# EAGLE design Relay_outputs1_double (EAGLE 7.5.0)
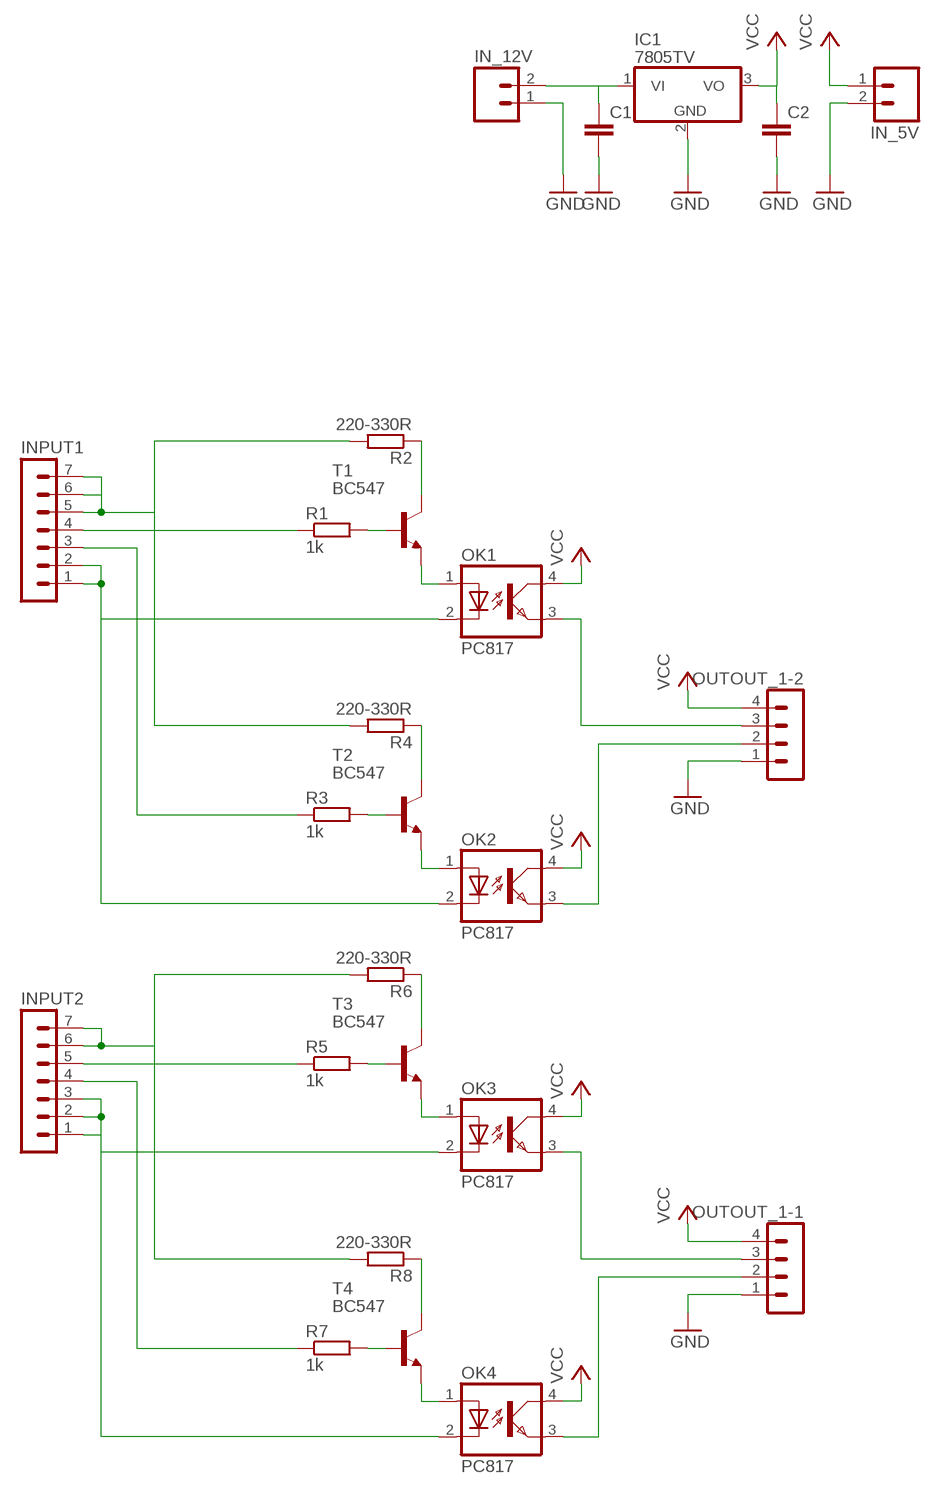
[diagram p0: schematic, sheet 1]

## Parts
C1  C-EU050-024X044  [C050-024X044]
C2  C-EU050-024X044  [C050-024X044]
IC1  7805TV  [TO220V]
IN_5V  MA02  [02PA]
IN_12V  MA02  [02PA]
INPUT1  MA07-1  [MA07-1]
INPUT2  MA07-1  [MA07-1]
OK1  PC817  [DIL04]
OK2  PC817  [DIL04]
OK3  PC817  [DIL04]
OK4  PC817  [DIL04]
OUTOUT_1-1  MA04-1  [MA04-1]
OUTOUT_1-2  MA04-1  [MA04-1]
R1  1k  R-EU_0207/10  [0207/10]
R2  220-330R  R-EU_0207/10  [0207/10]
R3  1k  R-EU_0207/10  [0207/10]
R4  220-330R  R-EU_0207/10  [0207/10]
R5  1k  R-EU_0207/10  [0207/10]
R6  220-330R  R-EU_0207/10  [0207/10]
R7  1k  R-EU_0207/10  [0207/10]
R8  220-330R  R-EU_0207/10  [0207/10]
T1  BC547  [TO92]
T2  BC547  [TO92]
T3  BC547  [TO92]
T4  BC547  [TO92]

## Nets
DC_IN: C1.1 IC1.1(VI) IN_12V.2
GND: C1.2 C2.2 IC1.2(GND) IN_5V.2 IN_12V.1 OUTOUT_1-1.1 OUTOUT_1-2.1
INPUT_REGULATED_CURR_2_BASE: R1.2 T1.2(B)
INPUT_REGULATED_CURR_2_BASE1: R3.2 T2.2(B)
INPUT_REGULATED_CURR_2_BASE2: R5.2 T3.2(B)
INPUT_REGULATED_CURR_2_BASE3: R7.2 T4.2(B)
N$1: R6.1 T3.3(C)
N$2: R2.1 T1.3(C)
N$3: R4.1 T2.3(C)
N$4: R8.1 T4.3(C)
OPTO_IN: OK1.1(A) T1.1(E)
OPTO_IN1: OK2.1(A) T2.1(E)
OPTO_IN2: OK3.1(A) T3.1(E)
OPTO_IN3: OK4.1(A) T4.1(E)
OUT1: OK1.3(EMIT) OUTOUT_1-2.3
OUT2: OK2.3(EMIT) OUTOUT_1-2.2
OUT3: OK3.3(EMIT) OUTOUT_1-1.3
OUT4: OK4.3(EMIT) OUTOUT_1-1.2
PI_GND: INPUT1.1 INPUT1.2 OK1.2(C) OK2.2(C)
PI_GND1: INPUT2.1 INPUT2.2 INPUT2.3 OK3.2(C) OK4.2(C)
PI_OUT_1: INPUT1.4 R1.1
PI_OUT_2: INPUT1.3 R3.1
PI_OUT_3: INPUT2.5 R5.1
PI_OUT_4: INPUT2.4 R7.1
PI_VCC: INPUT1.5 INPUT1.6 INPUT1.7 R2.2 R4.2
PI_VCC1: INPUT2.6 INPUT2.7 R6.2 R8.2
VCC: C2.1 IC1.3(VO) IN_5V.1 OK1.4(COL) OK2.4(COL) OK3.4(COL) OK4.4(COL) OUTOUT_1-1.4 OUTOUT_1-2.4

## Library data of the parts
C1 C2 = rcl:C-EU: CAPACITOR, European symbol
IC1 = linear:78*: Positive VOLTAGE REGULATOR Source: http://cache.national.com/ds/LM/LM78L05.pdf http://www.fairchildsemi.com/ds/LM/LM7805.pdf
IN_5V IN_12V = con-amp-quick:MA02: AMP QUICK CONNECTOR; OC_FARNELL: unknown; OC_NEWARK: unknown
INPUT1 INPUT2 = con-lstb:MA07-1: PIN HEADER; OC_FARNELL: unknown; OC_NEWARK: unknown
OK1-OK4 = optocoupler:PC817: SHARP OPTO COUPLER
OUTOUT_1-1 OUTOUT_1-2 = con-lstb:MA04-1: PIN HEADER; OC_FARNELL: unknown; OC_NEWARK: unknown
R1-R8 = rcl:R-EU_: RESISTOR, European symbol
T1-T4 = transistor-neu-to92:BC547: NPN TRANSISTOR

## Board
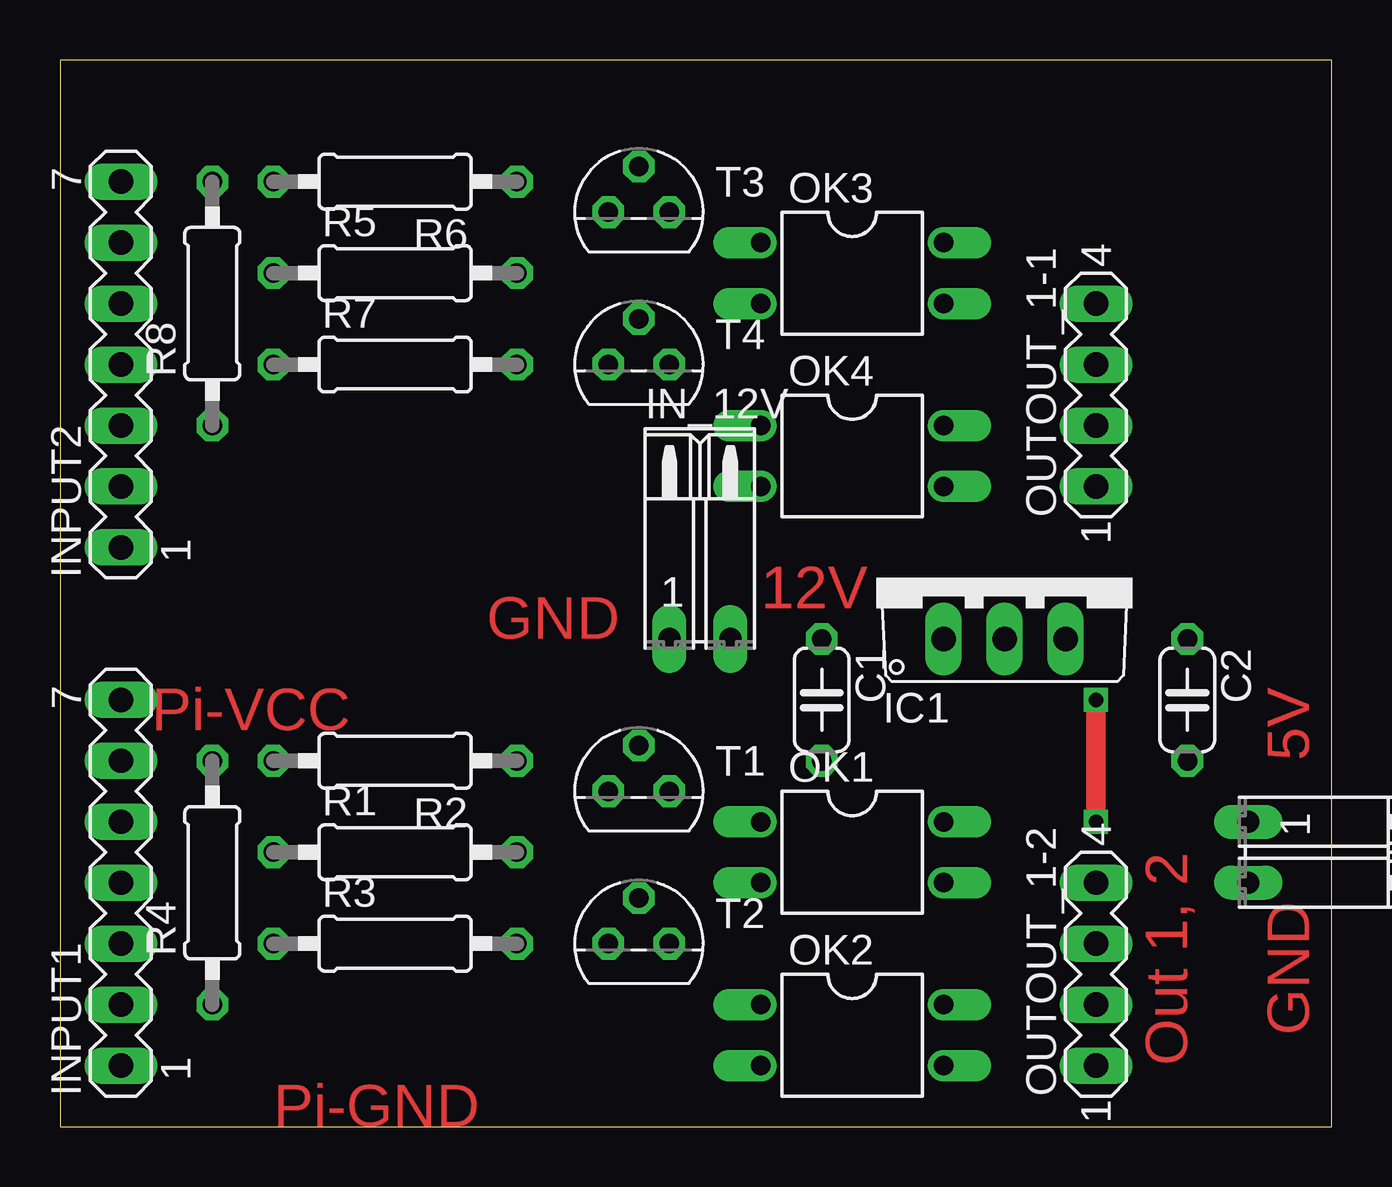
[diagram p1: board, top side]
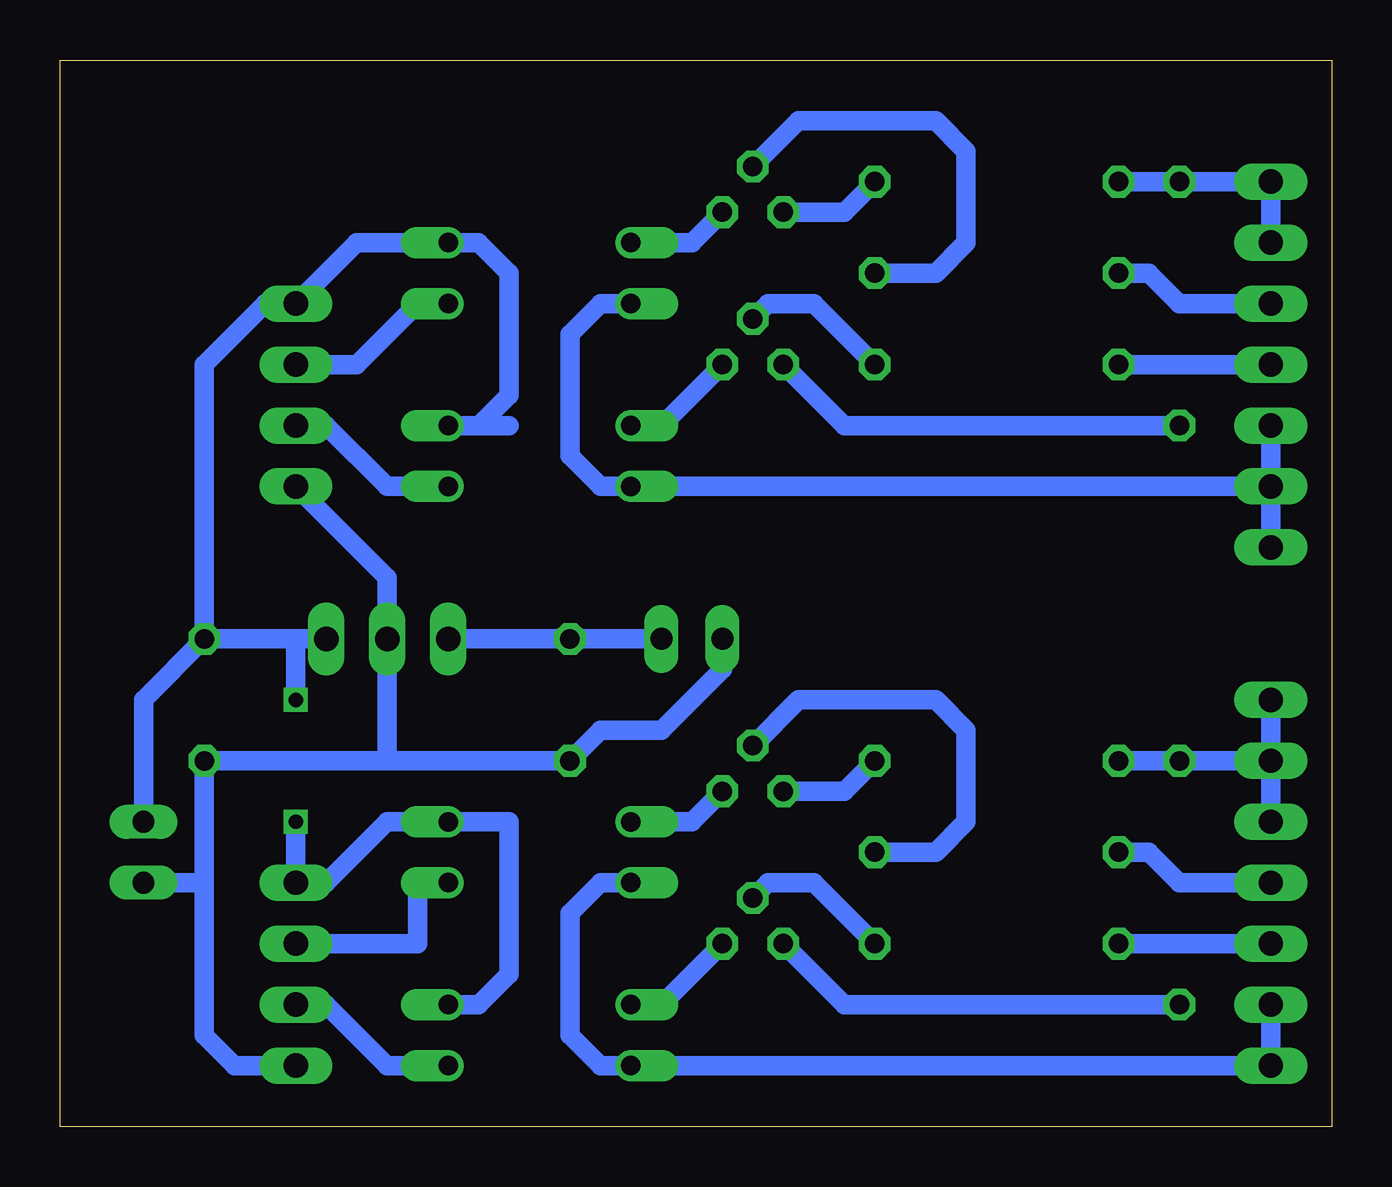
[diagram p2: board, bottom side, seen from below]

Size 53.01 x 44.44 mm. Coordinates in mm from the lower left corner, seen from the top.
Outline: 0,0 53.01,0 53.01,44.44 0,44.44 0,0
Copper layers (1*16): Top 0.035mm / dielectric 1.5mm / Bottom 0.035mm
Design rules "default": minimum track width 10mil, minimum drill 24mil, track to track 8mil, track to pad 8mil, pad to pad 8mil, via to via 8mil, smd to smd 8mil, copper to edge 40mil, drill to drill 8mil, minimum pad ring 10mil, minimum via ring 8mil, stop-mask expansion 4mil, vias tented up to drill 0mil, thermal gap 10mil

### Footprints (pad centres in the part's own frame; a part is rotated, then mirrored left to right if it is on the bottom)
C050-024X044 = drill 0.813 octagon: 1 -2.54,0; 2 2.54,0
TO220V = drill 1.016 long: 1 -2.54,-2.54; 2 0,-2.54; 3 2.54,-2.54
02PA = drill 0.914 long: 1 -1.27,0; 2 1.27,0
MA07-1 = drill 1.016 long: 1 -7.62,0; 2 -5.08,0; 3 -2.54,0; 4 0,0; 5 2.54,0; 6 5.08,0; 7 7.62,0
DIL04 = drill 0.813 offset: 1 -1.27,-3.81; 2 1.27,-3.81; 3 1.27,3.81; 4 -1.27,3.81
MA04-1 = drill 1.016 long: 1 -3.81,0; 2 -1.27,0; 3 1.27,0; 4 3.81,0
0207/10 = drill 0.813 octagon: 1 -5.08,0; 2 5.08,0
TO92 = drill 0.813 octagon: 1 1.27,0; 2 0,1.905; 3 -1.27,0

### Placement (x,y rotation side)
C1  31.75,17.78 270 top
C2  46.99,17.78 270 top
IC1  39.37,22.86 0 top
IN_5V  49.53,11.43 270 top
IN_12V  26.67,20.32 0 top
INPUT1  2.54,10.16 90 top
INPUT2  2.54,31.75 90 top
OK1  33.02,11.43 270 top
OK2  33.02,3.81 270 top
OK3  33.02,35.56 270 top
OK4  33.02,27.94 270 top
OUTOUT_1-1  43.18,30.48 90 top
OUTOUT_1-2  43.18,6.35 90 top
R1  13.97,11.43 0 top
R2  13.97,15.24 180 top
R3  13.97,7.62 0 top
R4  6.35,10.16 90 top
R5  13.97,35.56 0 top
R6  13.97,39.37 180 top
R7  13.97,31.75 0 top
R8  6.35,34.29 90 top
T1  24.13,13.97 0 top
T2  24.13,7.62 0 top
T3  24.13,38.1 0 top
T4  24.13,31.75 0 top

### Tracks (layer width: path | path; a pad name or v marks a point on that pad's centre or on a via)
DC_IN
  Bottom 0.813: IC1.1 C1.1 IN_12V.2
GND
  Bottom 0.813: 39.37,15.24 C2.2 46.99,10.16 | 39.37,15.24 C1.2 30.48,16.51 27.94,16.51 25.4,19.05 IN_12V.1 | OUTOUT_1-2.1 45.72,2.54 46.99,3.81 46.99,10.16 | 39.37,15.24 IC1.2 39.37,22.86 OUTOUT_1-1.1 | IN_5V.2 46.99,10.16
INPUT_REGULATED_CURR_2_BASE
  Bottom 0.813: R1.2 16.51,11.43 15.24,12.7 15.24,16.51 16.51,17.78 22.23,17.78 T1.2
INPUT_REGULATED_CURR_2_BASE1
  Bottom 0.813: R3.2 21.59,10.16 23.5,10.16 T2.2
INPUT_REGULATED_CURR_2_BASE2
  Bottom 0.813: R5.2 16.51,35.56 15.24,36.83 15.24,40.64 16.51,41.91 22.23,41.91 T3.2
INPUT_REGULATED_CURR_2_BASE3
  Bottom 0.813: R7.2 21.59,34.29 23.5,34.29 T4.2
N$1
  Bottom 0.813: T3.3 20.32,38.1 R6.1
N$2
  Bottom 0.813: T1.3 20.32,13.97 R2.1
N$3
  Bottom 0.813: R4.1 20.32,5.08 T2.3
N$4
  Bottom 0.813: R8.1 20.32,29.21 T4.3
OPTO_IN
  Bottom 0.813: OK1.1 26.67,12.7 T1.1
OPTO_IN1
  Bottom 0.813: OK2.1 27.94,5.08 T2.1
OPTO_IN2
  Bottom 0.813: OK3.1 26.67,36.83 T3.1
OPTO_IN3
  Bottom 0.813: OK4.1 27.94,29.21 T4.1
OUT1
  Bottom 0.813: OK1.3 38.1,10.16 38.1,7.62 OUTOUT_1-2.3
OUT2
  Bottom 0.813: OUTOUT_1-2.2 41.91,5.08 39.37,2.54 OK2.3
OUT3
  Bottom 0.813: OUTOUT_1-1.3 40.64,31.75 38.1,34.29 OK3.3
OUT4
  Bottom 0.813: OK4.3 39.37,26.67 41.91,29.21 OUTOUT_1-1.2
PI_GND
  Bottom 0.813: OK1.2 30.48,10.16 31.75,8.89 31.75,3.81 30.48,2.54 OK2.2 INPUT1.1 INPUT1.2
PI_GND1
  Bottom 0.813: OK3.2 30.48,34.29 31.75,33.02 31.75,27.94 30.48,26.67 OK4.2 INPUT2.2 | INPUT2.3 INPUT2.2 | INPUT2.1 INPUT2.2
PI_OUT_1
  Bottom 0.813: R1.1 7.62,11.43 6.35,10.16 INPUT1.4
PI_OUT_2
  Bottom 0.813: INPUT1.3 R3.1
PI_OUT_3
  Bottom 0.813: R5.1 7.62,35.56 6.35,34.29 INPUT2.5
PI_OUT_4
  Bottom 0.813: INPUT2.4 R7.1
PI_VCC
  Bottom 0.813: R2.2 R4.2 INPUT1.6 | INPUT1.5 INPUT1.6 | INPUT1.7 INPUT1.6
PI_VCC1
  Bottom 0.813: R6.2 R8.2 INPUT2.7 INPUT2.6
VCC  (via drill 0.6)
  Top 0.813: v43.18,12.7 v43.18,17.78
  Bottom 0.813: OK2.4 35.56,5.08 34.29,6.35 34.29,12.7 OK1.4 39.37,12.7 41.91,10.16 OUTOUT_1-2.4 v43.18,12.7 | C2.1 43.18,20.32 | 43.18,20.32 IC1.3 C2.1 | v43.18,17.78 43.18,20.32 | IN_5V.1 49.53,17.78 C2.1 | 34.29,29.21 OK4.4 35.56,29.21 34.29,30.48 34.29,35.56 35.56,36.83 OK3.4 40.64,36.83 OUTOUT_1-1.4 44.45,34.29 46.99,31.75 C2.1

### Text on the board
Top: 12V | GND | Pi-VCC | 5V | GND | Out 1, 2 | Pi-GND